# EAGLE design Quad v1.0 (EAGLE 6.6.0)
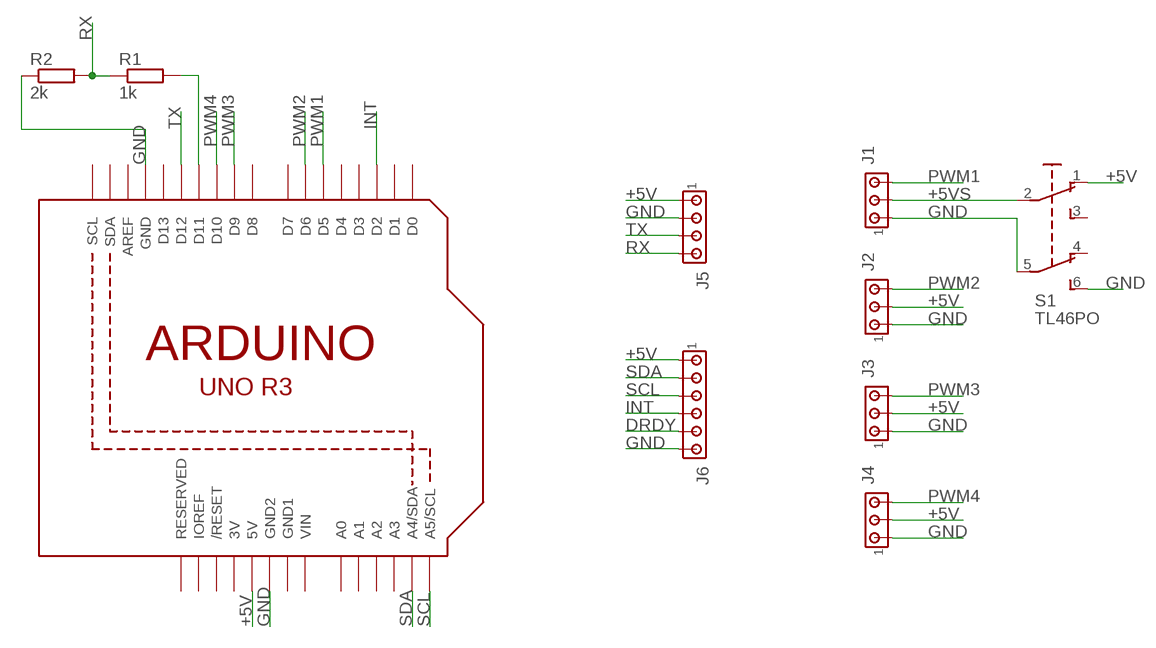
[diagram p0: schematic, sheet 1]

## Parts
J1  MTA03-100  [10X03MTA]
J2  MTA03-100  [10X03MTA]
J3  MTA03-100  [10X03MTA]
J4  MTA03-100  [10X03MTA]
J5  MTA04-100  [10X04MTA]
J6  MTA06-100  [10X06MTA]
R1  1k  R-EU_0204/7  [0204/7]
R2  2k  R-EU_0204/7  [0204/7]
S1  TL46PO  [TL4XPO]
U1  ARDUINOR3-DIMENSION  [ARDUINOR3]

## Nets
+5V: J2.2 J3.2 J4.2 J5.1 J6.6 S1.1(O) U1.5V
+5VS: J1.2 S1.2(P)
DRDY: J6.2
GND: J1.1 J2.1 J3.1 J4.1 J5.2 J6.1 R2.1 S1.5(P1) S1.6(S1) U1.GND U1.GND2
INT: J6.3 U1.D2
N$1: R1.2 U1.D11
PWM1: J1.3 U1.D5
PWM2: J2.3 U1.D6
PWM3: J3.3 U1.D9
PWM4: J4.3 U1.D10
RX: J5.4 R1.1 R2.2
SCL: J6.4 U1.A5(A5/SCL)
SDA: J6.5 U1.A4(A4/SDA)
TX: J5.3 U1.D12
Unconnected: S1.3(S) S1.4(O1) U1.A0 U1.A1 U1.A2 U1.A3 U1.AREF U1.D0 U1.D1 U1.D3 U1.D4 U1.D7 U1.D8 U1.D13 U1.IOREF U1.RESERVED U1.RESET(/RESET) U1.SCL U1.SDA

## Power pins joined to a net without a drawn wire
3V: U1.3V
GND1: U1.GND1
VIN: U1.VIN

## Library data of the parts
J1-J4 = con-amp:MTA03-100: AMP connector
J5 = con-amp:MTA04-100: AMP connector
J6 = con-amp:MTA06-100: AMP connector
R1 R2 = resistor:R-EU_: RESISTOR, European symbol
S1 = switch:TL46PO: TINY SWITCH ON - ON Source: http://www2.produktinfo.conrad.com/datenblaetter/700000-724999/705152-da-01-de-Subminiaturschalter_TL_36YO.pdf
U1 = adafruit:ARDUINOR3: This is a new object for the new Arduino R3 - with extra pins that you may want to use (such as IOref, and duplicated A4/A5

## Board
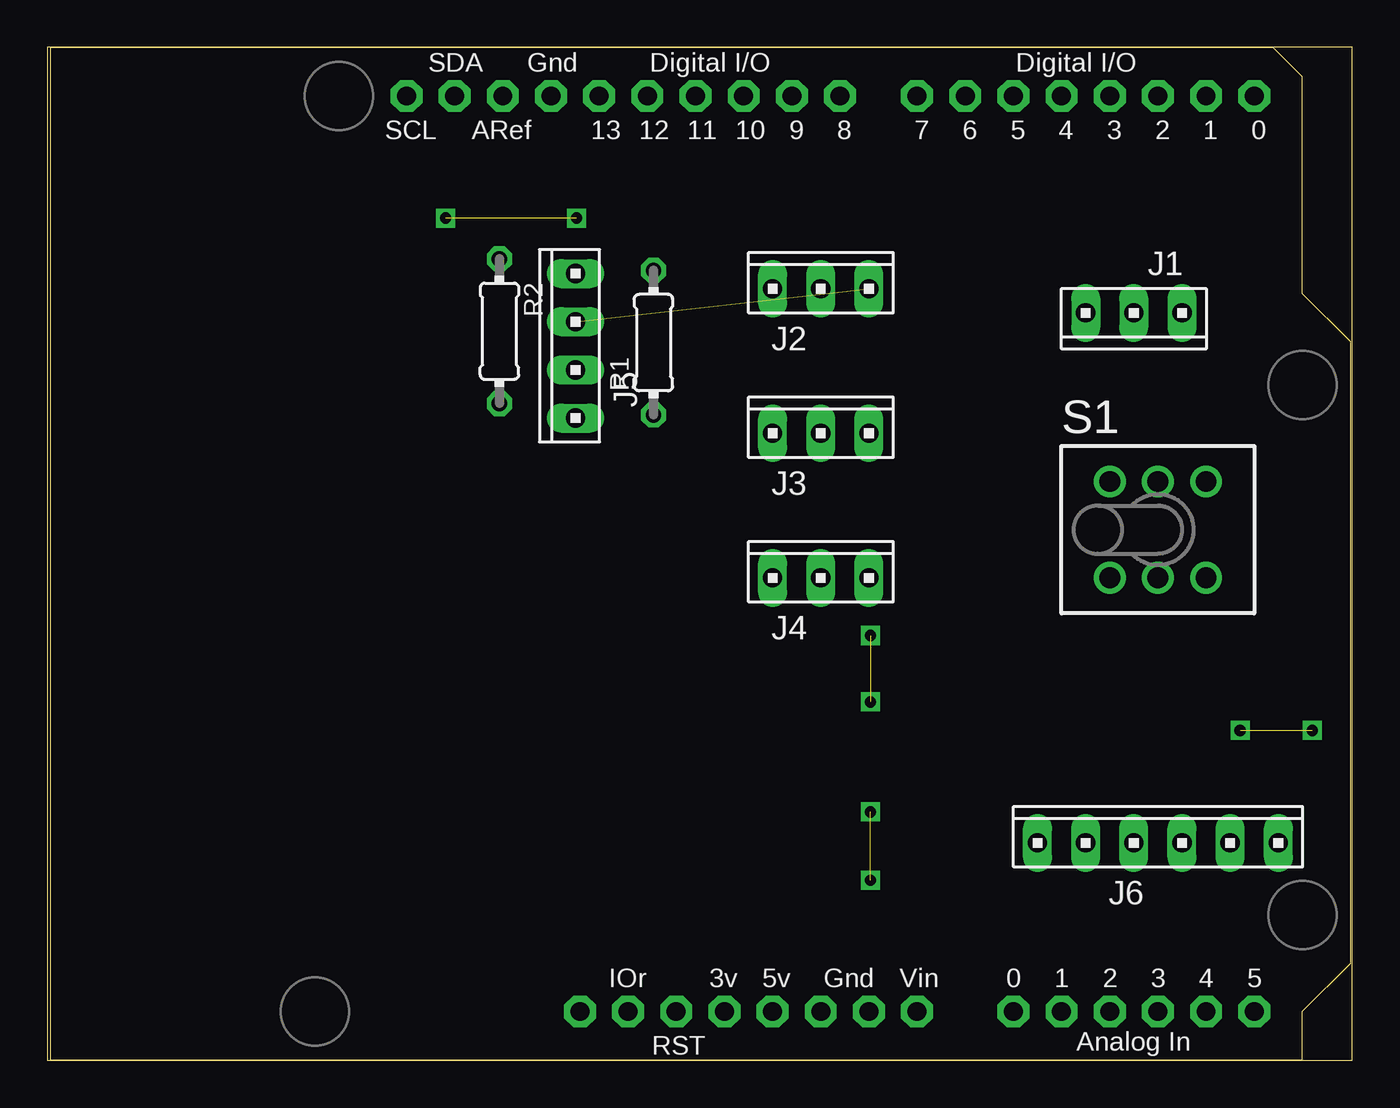
[diagram p1: board, top side]
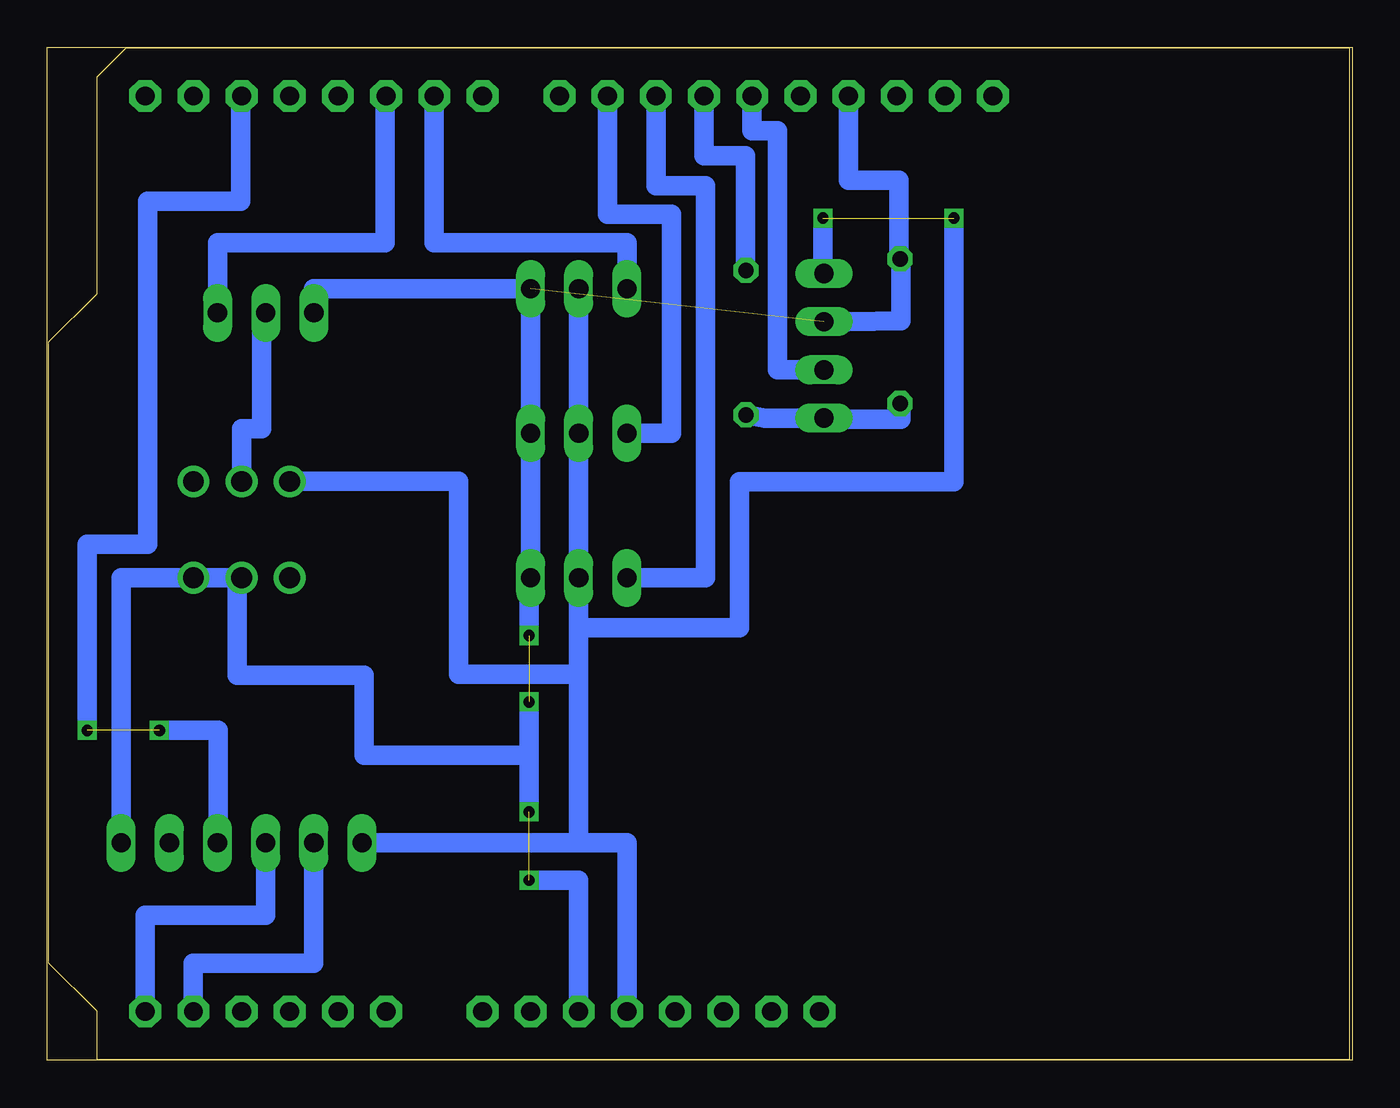
[diagram p2: board, bottom side, seen from below]

Size 68.8 x 53.4 mm. Coordinates in mm from the lower left corner, seen from the top.
Outline: 0,0 68.8,0 68.8,53.4 0,53.4 0,0
Copper layers (1*16): Top 0.035mm / dielectric 1.5mm / Bottom 0.035mm
Design rules "default": minimum track width 10mil, minimum drill 24mil, track to track 8mil, track to pad 8mil, pad to pad 8mil, via to via 8mil, smd to smd 8mil, copper to edge 40mil, drill to drill 8mil, minimum pad ring 10mil, minimum via ring 8mil, stop-mask expansion 4mil, vias tented up to drill 0mil, thermal gap 10mil

### Footprints (pad centres in the part's own frame; a part is rotated, then mirrored left to right if it is on the bottom)
10X03MTA = drill 1.016 long: 1 2.54,0; 2 0,0; 3 -2.54,0
10X04MTA = drill 1.016 long: 1 3.81,0; 2 1.27,0; 3 -1.27,0; 4 -3.81,0
10X06MTA = drill 1.016 long: 1 6.35,0; 2 3.81,0; 3 1.27,0; 4 -1.27,0; 5 -3.81,0; 6 -6.35,0
0204/7 = drill 0.813 octagon: 1 -3.81,0; 2 3.81,0
TL4XPO = drill 1.1 pad 1.676: 1 -2.54,2.54; 2 0,2.54; 3 2.54,2.54; 4 -2.54,-2.54; 5 0,-2.54; 6 2.54,-2.54
ARDUINOR3 = drill 1 pad 1.676 octagon: 3V 35.56,2.54; 5V 38.1,2.54; A0 50.8,2.54; A1 53.34,2.54; A2 55.88,2.54; A3 58.42,2.54; A4 60.96,2.54; A5 63.5,2.54; AREF 23.876,50.8; D0 63.5,50.8; D1 60.96,50.8; D2 58.42,50.8; D3 55.88,50.8; D4 53.34,50.8; D5 50.8,50.8; D6 48.26,50.8; D7 45.72,50.8; D8 41.656,50.8; D9 39.116,50.8; D10 36.576,50.8; D11 34.036,50.8; D12 31.496,50.8; D13 28.956,50.8; GND 26.416,50.8; GND1 43.18,2.54; GND2 40.64,2.54; IOREF 30.48,2.54; RESERVED 27.94,2.54; RESET 33.02,2.54; SCL 18.796,50.8; SDA 21.336,50.8; VIN 45.72,2.54

### Placement (x,y rotation side)
J1  57.29,39.41 180 top
J2  40.78,40.68 0 top
J3  40.78,33.06 0 top
J4  40.78,25.44 0 top
J5  27.85,37.67 90 top
J6  58.56,11.47 0 top
R1  31.96,37.84 90 top
R2  23.84,38.44 270 top
S1  58.56,27.98 0 top
U1  0.14,0.04 0 top

### Tracks (layer width: path | path; a pad name or v marks a point on that pad's centre or on a via)
+5V  (via drill 0.6)  (1 unrouted)
  Bottom 1.016: U1.5V 38.24,11.47 40.78,11.47 | 40.78,11.47 J6.6 | 40.78,22.8 J4.2 J3.2 J2.2 | 40.78,22.8 40.78,20.36 | 40.78,20.36 40.78,11.47 | S1.1 47.13,30.52 47.13,20.36 40.78,20.36 | J5.1 27.9,41.48 v27.9,44.4 | v21,44.4 21,30.5 32.3,30.5 32.3,22.8 40.78,22.8
+5VS
  Bottom 1.016: J1.2 57.5,39.41 57.5,33.3 58.56,33.3 S1.2
GND  (via drill 0.6)  (3 unrouted)
  Bottom 1.016: J6.1 64.91,25.44 S1.6 S1.5 58.8,25.44 58.8,20.3 52.1,20.3 52.1,16.1 43.4,16.1 | J1.1 54.75,40.68 J2.1 J3.1 J4.1 43.4,25.44 v43.4,22.4 | U1.GND 26.56,46.4 23.9,46.4 23.9,42.25 R2.1 23.8,42.35 23.8,39 27.85,38.9 J5.2 | 43.4,16.1 v43.4,13.1 | 43.4,16.1 v43.4,18.9 | U1.GND2 40.8,2.58 40.8,9.5 v43.4,9.5
INT  (via drill 0.6)  (1 unrouted)
  Bottom 1.016: U1.D2 58.6,50.84 58.6,45.3 63.5,45.3 63.5,27.2 66.7,27.2 v66.7,17.4 | J6.3 59.8,11.47 59.8,17.4 v62.9,17.4
N$1
  Bottom 1.016: R1.2 32,41.65 32,47.7 34.18,47.7 U1.D11
PWM1
  Bottom 1.016: U1.D5 51,50.84 51,43.1 59.83,43.1 J1.3
PWM2
  Bottom 1.016: U1.D6 48.4,43.1 38.24,43.1 J2.3
PWM3
  Bottom 1.016: J3.3 35.9,33.06 35.9,44.6 39.26,44.6 U1.D9
PWM4
  Bottom 1.016: J4.3 34.1,25.44 34.1,46.1 36.72,46.1 U1.D10
RX
  Bottom 1.016: R1.1 30.96,33.86 J5.4 27.85,33.8 23.8,33.8 23.8,34.63 R2.2
SCL
  Bottom 1.016: J6.4 57.29,7.66 63.64,7.66 U1.A5
SDA
  Bottom 1.016: J6.5 54.75,5.12 61.1,5.12 U1.A4
TX
  Bottom 1.016: J5.3 30.3,36.4 30.3,49 31.64,49 U1.D12